# EAGLE design vc_board_v011 (EAGLE 9.6.2)
Wifi2Dmx Bridge WeMos D1 mini MAX485 (SO8) Neutrik NC1FAH1 5050 RGB LED BESTELLT: 30.06.2020
DNAME: Ruemmler, Elias
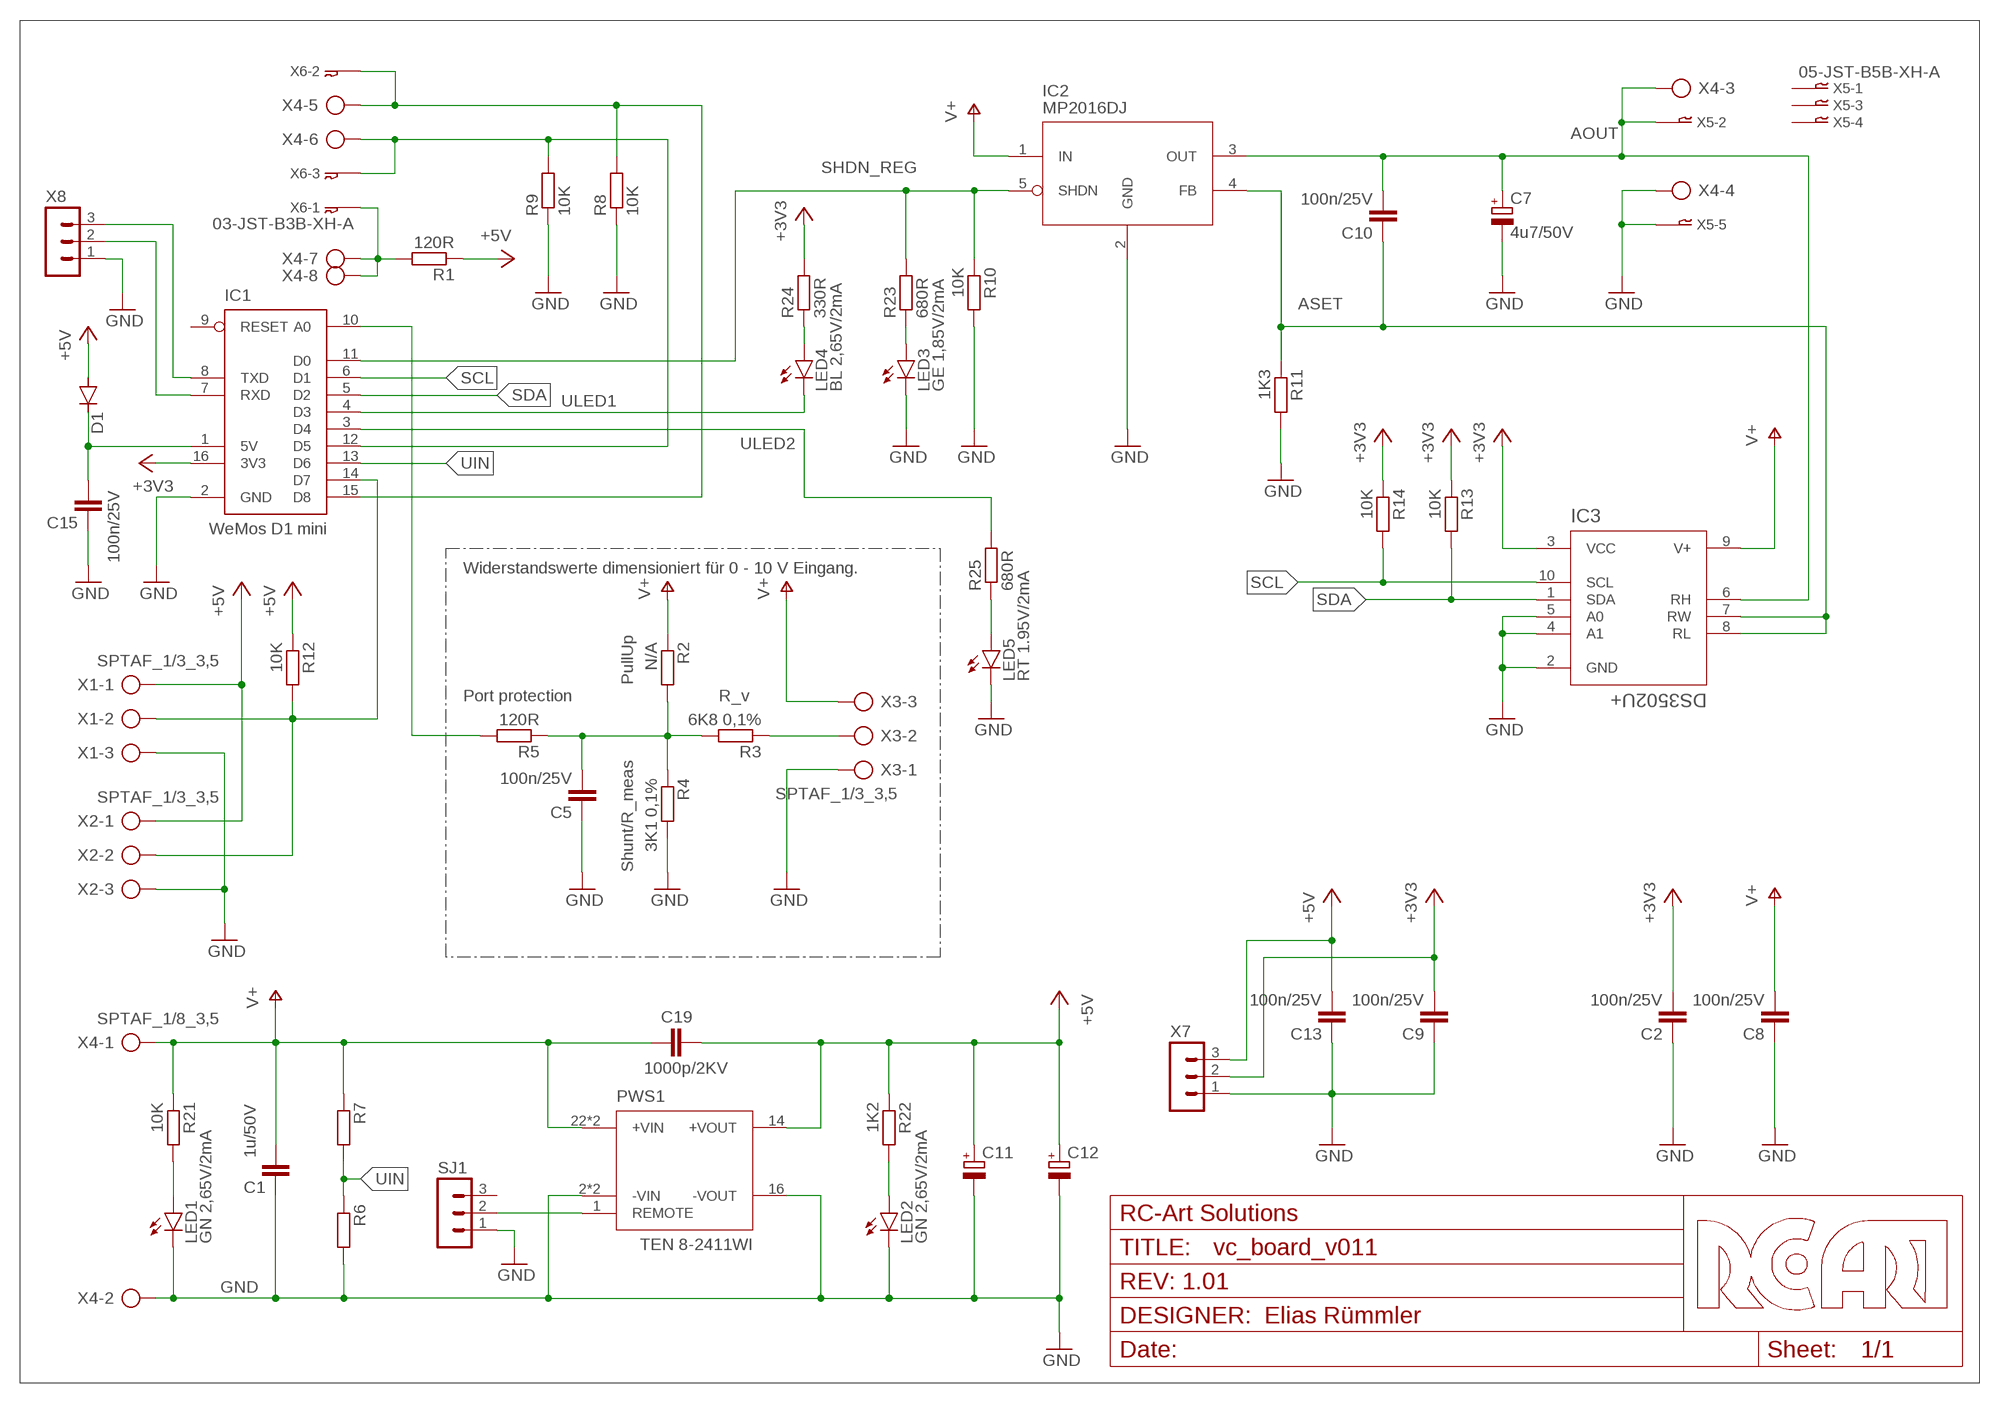
[diagram p0: schematic, sheet 1]

## Parts
C1  1u/50V  C-EUC1210K  [C1210K]
C2  100n/25V  C-EUC0805  [C0805]
C5  100n/25V  C-EUC0805  [C0805]
C7  4u7/50V  CPOL-EUD/7343-31W  [D/7343-31W]
C8  100n/25V  C-EUC0805  [C0805]
C9  100n/25V  C-EUC0805  [C0805]
C10  100n/25V  C-EUC0805  [C0805]
C11  CPOL-EUD/7343-31W  [D/7343-31W]
C12  CPOL-EUD/7343-31W  [D/7343-31W]
C13  100n/25V  C-EUC0805  [C0805]
C15  100n/25V  C-EUC0805  [C0805]
C19  1000p/2KV  C-EUC1206K  [C1206K]
D1  DIODE-SMB  [SMB]
FRAME1  MF_FRAMEDEFAULT  [MF_FRAME_DEFAULT]
IC1  WeMos D1 mini  D1_MINI  [D1_MINI]
IC2  MP2016DJ  MP2016  [TSOT23-5]
IC3  DS3502U+  [21-0061L_MXM]
LED1  GN 2,65V/2mA  LEDCHIPLED_0805  [CHIPLED_0805]
LED2  GN 2,65V/2mA  LEDCHIPLED_0805  [CHIPLED_0805]
LED3  GE 1,85V/2mA  LEDCHIPLED_0805  [CHIPLED_0805]
LED4  BL 2,65V/2mA  LEDCHIPLED_0805  [CHIPLED_0805]
LED5  RT 1.95V/2mA  LEDCHIPLED_0805  [CHIPLED_0805]
PWS1  TEN 8-2411WI  TEN8WI  [TEN8]
R1  120R  R-EU_R0805  [R0805]
R2  N/A  R-EU_R0805  [R0805]
R3  6K8 0,1%  R-EU_R0805  [R0805]
R4  3K1 0,1%  R-EU_R0805  [R0805]
R5  120R  R-EU_R0805  [R0805]
R6  R-EU_R0805  [R0805]
R7  R-EU_R0805  [R0805]
R8  10K  R-EU_R0805  [R0805]
R9  10K  R-EU_R0805  [R0805]
R10  10K  R-EU_R0805  [R0805]
R11  1K3  R-EU_R0805  [R0805]
R12  10K  R-EU_R0805  [R0805]
R13  10K  R-EU_R0805  [R0805]
R14  10K  R-EU_R0805  [R0805]
R21  10K  R-EU_R0805  [R0805]
R22  1K2  R-EU_R0805  [R0805]
R23  680R  R-EU_R0805  [R0805]
R24  330R  R-EU_R0805  [R0805]
R25  680R  R-EU_R0805  [R0805]
SJ1  MA03-1  [MA03-1]
X1  SPTAF_1/3_3,5  [SPTAF_1/3_3,5]
X2  SPTAF_1/3_3,5  [SPTAF_1/3_3,5]
X3  SPTAF_1/3_3,5  [SPTAF_1/3_3,5]
X4  SPTAF_1/8_3,5  [SPTAF_1/8_3,5]
X5  05-JST-B5B-XH-A  [B5B-XH]
X6  03-JST-B3B-XH-A  [B3B-XH]
X7  MA03-1  [MA03-1]
X8  MA03-1  [MA03-1]

## Nets
+3V3: C2.2 C9.2 IC1.16(3V3) IC3.3(VCC) R13.1 R14.1 R24.2 X7.2
+5V: C11.+ C12.+ C13.2 C19.2 D1.A PWS1.14(+VOUT) R1.1 R12.1 R22.1 X1.1 X1.1A X2.1 X2.1A X7.3
AOUT: C7.+ C10.2 IC2.3(OUT) IC3.6(RH) X4.3 X4.3A X5.P$2
ASET: C10.1 IC2.4(FB) IC3.7(RW) IC3.8(RL) R11.1
GND [gnd]: C1.1 C2.1 C5.1 C7.- C8.1 C9.1 C11.- C12.- C13.1 C15.1 IC1.2(GND) IC2.2(GND) IC3.2(GND) IC3.4(A1) IC3.5(A0) LED1.C LED2.C LED3.C LED5.C PWS1.2(-VIN) PWS1.3(-VIN) PWS1.16(-VOUT) R4.2 R6.2 R8.1 R9.1 R10.2 R11.2 SJ1.1 X1.3 X1.3A X2.3 X2.3A X3.1 X3.1A X4.2 X4.2A X4.4 X4.4A X5.P$5 X7.1 X8.1
N$1: C5.2 R2.2 R3.2 R4.1 R5.1
N$2: IC1.12(D5) R9.2 X4.6 X4.6A X6.P$3
N$3: IC1.15(D8) R8.2 X4.5 X4.5A X6.P$2
N$5: R1.2 X4.7 X4.7A X4.8 X4.8A X6.P$1
N$6: R3.1 X3.2 X3.2A
N$7: C15.2 D1.C IC1.1(5V)
N$8: PWS1.1(REMOTE) SJ1.2
N$10: LED3.A R23.1
N$13: LED1.A R21.2
N$14: LED2.A R22.2
N$15: IC1.14(D7) R12.2 X1.2 X1.2A X2.2 X2.2A
N$16: IC1.8(TXD) X8.3
N$17: IC1.7(RXD) X8.2
N$18: LED4.A R24.1
N$19: LED5.A R25.1
N$21: IC1.10(A0) R5.2
SCL: IC1.6(D1) IC3.10(SCL) R14.2
SDA: IC1.5(D2) IC3.1(SDA) R13.2
SHDN_REG: IC1.11(D0) IC2.5(SHDN) R10.1 R23.2
UIN: IC1.13(D6) R6.1 R7.2
ULED1: IC1.4(D3) LED4.C
ULED2: IC1.3(D4) R25.2
V+: C1.2 C8.2 C19.1 IC2.1(IN) IC3.9(V+) PWS1.22(+VIN) PWS1.23(+VIN) R2.1 R7.1 R21.1 X3.3 X3.3A X4.1 X4.1A
Unconnected: IC1.9(RESET) SJ1.3 X5.P$1 X5.P$3 X5.P$4

## Notes on the sheet
- Widerstandswerte dimensioniert für 0 - 10 V Eingang.
- PullUp
- Port protection | R_v
- Shunt/R_meas

## Library data of the parts
C1 C2 C5 C8-C10 C13 C15 C19 = rcl:C-EU: CAPACITOR, European symbol; SPICEPREFIX: C
C7 C11 C12 = rcl:CPOL-EU: POLARIZED CAPACITOR, European symbol; SPICEPREFIX: C
D1 = diode:DIODE-: DIODE
FRAME1 = rca-frames:MF_FRAME: Library: MF_Aesthetics Description: Frame for adding Meta Data to the PCB and Schematic.; DNAME: Elias Rümmler; HOUSEPART: 0; POPULATE: 0; REVNUM: REV: 1.01
IC1 = rca-wemos:D1_MINI
IC2 = mps-regulator:MP2016: MP2016 The MP2016 is a low power linear regulator that supplies power to systems with high voltage batteries. It includes a wide 4V to 42V input range, low dropout voltage and low quiescent supply current.
IC3 = maxim-ds3502:DS3502U+; BUILT_BY: EMA_UL_Team; MANUFACTURER_PART_NUMBER: ds3502u+; REVISION: 2; SOURCELIBRARY: Maxim_2009-12-17_1; VENDOR: Maxim Integrated Products
LED1 LED2 = led:LED: LED OSRAM: - CHIPLED LG R971, LG N971, LY N971, LG Q971, LY Q971, LO R971, LY R971 LH N974, LH R974 LS Q976, LO Q976, LY Q976 LO Q996 - Hyper CHIPLED LW Q18S LB Q993, LB Q99A, LB R99A - SideLED LS A670, LO A670, LY A670, LG A670, LP A670 LB A673, LV A673, LT A673, LW A673 LH A674 LY A675 LS A676, LA A676, LO A676, LY A676, LW A676 LS A679, LY A679, LG A679 - Hyper Micro SIDELED® LS Y876, LA Y876, LO Y876, LY Y876 LT Y87S - SmartLED LW L88C, LW L88S LB L89C, LB L89S, LG L890 LS L89K, LO L89K, LY L89K LS L896, LA L896, LO L896, LY L896 - TOPLED LS T670, LO T670, LY T670, LG T670, LP T670 LSG T670, LSP T670, LSY T670, LOP T670, LYG T670 LG T671, LOG T671, LSG T671 LB T673, LV T673, LT T673, LW T673 LH T674 LS T676, LA T676, LO T676, LY T676, LB T676, LH T676, LSB T676, LW T676 LB T67C, LV T67C, LT T67C, LS T67K, LO T67K, LY T67K, LW E67C LS E67B, LA E67B, LO E67B, LY E67B, LB E67C, LV E67C, LT E67C LW T67C LS T679, LY T679, LG T679 LS T770, LO T770, LY T770, LG T770, LP T770 LB T773, LV T773, LT T773, LW T773 LH T774 LS E675, LA E675, LY E675, LS T675 LS T776, LA T776, LO T776, LY T776, LB T776 LHGB T686 LT T68C, LB T68C - Hyper Mini TOPLED® LB M676 - Mini TOPLED Santana® LG M470 LS M47K, LO M47K, LY M47K Source: http://www.osram.convergy.de LUXEON: - LUMILED® LXK2-PW12-R00, LXK2-PW12-S00, LXK2-PW14-U00, LXK2-PW14-V00 LXK2-PM12-R00, LXK2-PM12-S00, LXK2-PM14-U00 LXK2-PE12-Q00, LXK2-PE12-R00, LXK2-PE12-S00, LXK2-PE14-T00, LXK2-PE14-U00 LXK2-PB12-K00, LXK2-PB12-L00, LXK2-PB12-M00, LXK2-PB14-N00, LXK2-PB14-P00, LXK2-PB14-Q00 LXK2-PR12-L00, LXK2-PR12-M00, LXK2-PR14-Q00, LXK2-PR14-R00 LXK2-PD12-Q00, LXK2-PD12-R00, LXK2-PD12-S00 LXK2-PH12-R00, LXK2-PH12-S00 LXK2-PL12-P00, LXK2-PL12-Q00, LXK2-PL12-R00 Source: www.luxeon.com KINGBRIGHT: KA-3528ASYC Source: www.kingbright.com; FARNELL_SKU: 2846598
LED3 = led:LED: LED OSRAM: - CHIPLED LG R971, LG N971, LY N971, LG Q971, LY Q971, LO R971, LY R971 LH N974, LH R974 LS Q976, LO Q976, LY Q976 LO Q996 - Hyper CHIPLED LW Q18S LB Q993, LB Q99A, LB R99A - SideLED LS A670, LO A670, LY A670, LG A670, LP A670 LB A673, LV A673, LT A673, LW A673 LH A674 LY A675 LS A676, LA A676, LO A676, LY A676, LW A676 LS A679, LY A679, LG A679 - Hyper Micro SIDELED® LS Y876, LA Y876, LO Y876, LY Y876 LT Y87S - SmartLED LW L88C, LW L88S LB L89C, LB L89S, LG L890 LS L89K, LO L89K, LY L89K LS L896, LA L896, LO L896, LY L896 - TOPLED LS T670, LO T670, LY T670, LG T670, LP T670 LSG T670, LSP T670, LSY T670, LOP T670, LYG T670 LG T671, LOG T671, LSG T671 LB T673, LV T673, LT T673, LW T673 LH T674 LS T676, LA T676, LO T676, LY T676, LB T676, LH T676, LSB T676, LW T676 LB T67C, LV T67C, LT T67C, LS T67K, LO T67K, LY T67K, LW E67C LS E67B, LA E67B, LO E67B, LY E67B, LB E67C, LV E67C, LT E67C LW T67C LS T679, LY T679, LG T679 LS T770, LO T770, LY T770, LG T770, LP T770 LB T773, LV T773, LT T773, LW T773 LH T774 LS E675, LA E675, LY E675, LS T675 LS T776, LA T776, LO T776, LY T776, LB T776 LHGB T686 LT T68C, LB T68C - Hyper Mini TOPLED® LB M676 - Mini TOPLED Santana® LG M470 LS M47K, LO M47K, LY M47K Source: http://www.osram.convergy.de LUXEON: - LUMILED® LXK2-PW12-R00, LXK2-PW12-S00, LXK2-PW14-U00, LXK2-PW14-V00 LXK2-PM12-R00, LXK2-PM12-S00, LXK2-PM14-U00 LXK2-PE12-Q00, LXK2-PE12-R00, LXK2-PE12-S00, LXK2-PE14-T00, LXK2-PE14-U00 LXK2-PB12-K00, LXK2-PB12-L00, LXK2-PB12-M00, LXK2-PB14-N00, LXK2-PB14-P00, LXK2-PB14-Q00 LXK2-PR12-L00, LXK2-PR12-M00, LXK2-PR14-Q00, LXK2-PR14-R00 LXK2-PD12-Q00, LXK2-PD12-R00, LXK2-PD12-S00 LXK2-PH12-R00, LXK2-PH12-S00 LXK2-PL12-P00, LXK2-PL12-Q00, LXK2-PL12-R00 Source: www.luxeon.com KINGBRIGHT: KA-3528ASYC Source: www.kingbright.com; FARNELL_SKU: 2846596
LED4 = led:LED: LED OSRAM: - CHIPLED LG R971, LG N971, LY N971, LG Q971, LY Q971, LO R971, LY R971 LH N974, LH R974 LS Q976, LO Q976, LY Q976 LO Q996 - Hyper CHIPLED LW Q18S LB Q993, LB Q99A, LB R99A - SideLED LS A670, LO A670, LY A670, LG A670, LP A670 LB A673, LV A673, LT A673, LW A673 LH A674 LY A675 LS A676, LA A676, LO A676, LY A676, LW A676 LS A679, LY A679, LG A679 - Hyper Micro SIDELED® LS Y876, LA Y876, LO Y876, LY Y876 LT Y87S - SmartLED LW L88C, LW L88S LB L89C, LB L89S, LG L890 LS L89K, LO L89K, LY L89K LS L896, LA L896, LO L896, LY L896 - TOPLED LS T670, LO T670, LY T670, LG T670, LP T670 LSG T670, LSP T670, LSY T670, LOP T670, LYG T670 LG T671, LOG T671, LSG T671 LB T673, LV T673, LT T673, LW T673 LH T674 LS T676, LA T676, LO T676, LY T676, LB T676, LH T676, LSB T676, LW T676 LB T67C, LV T67C, LT T67C, LS T67K, LO T67K, LY T67K, LW E67C LS E67B, LA E67B, LO E67B, LY E67B, LB E67C, LV E67C, LT E67C LW T67C LS T679, LY T679, LG T679 LS T770, LO T770, LY T770, LG T770, LP T770 LB T773, LV T773, LT T773, LW T773 LH T774 LS E675, LA E675, LY E675, LS T675 LS T776, LA T776, LO T776, LY T776, LB T776 LHGB T686 LT T68C, LB T68C - Hyper Mini TOPLED® LB M676 - Mini TOPLED Santana® LG M470 LS M47K, LO M47K, LY M47K Source: http://www.osram.convergy.de LUXEON: - LUMILED® LXK2-PW12-R00, LXK2-PW12-S00, LXK2-PW14-U00, LXK2-PW14-V00 LXK2-PM12-R00, LXK2-PM12-S00, LXK2-PM14-U00 LXK2-PE12-Q00, LXK2-PE12-R00, LXK2-PE12-S00, LXK2-PE14-T00, LXK2-PE14-U00 LXK2-PB12-K00, LXK2-PB12-L00, LXK2-PB12-M00, LXK2-PB14-N00, LXK2-PB14-P00, LXK2-PB14-Q00 LXK2-PR12-L00, LXK2-PR12-M00, LXK2-PR14-Q00, LXK2-PR14-R00 LXK2-PD12-Q00, LXK2-PD12-R00, LXK2-PD12-S00 LXK2-PH12-R00, LXK2-PH12-S00 LXK2-PL12-P00, LXK2-PL12-Q00, LXK2-PL12-R00 Source: www.luxeon.com KINGBRIGHT: KA-3528ASYC Source: www.kingbright.com; FARNELL_SKU: 2846594
LED5 = led:LED: LED OSRAM: - CHIPLED LG R971, LG N971, LY N971, LG Q971, LY Q971, LO R971, LY R971 LH N974, LH R974 LS Q976, LO Q976, LY Q976 LO Q996 - Hyper CHIPLED LW Q18S LB Q993, LB Q99A, LB R99A - SideLED LS A670, LO A670, LY A670, LG A670, LP A670 LB A673, LV A673, LT A673, LW A673 LH A674 LY A675 LS A676, LA A676, LO A676, LY A676, LW A676 LS A679, LY A679, LG A679 - Hyper Micro SIDELED® LS Y876, LA Y876, LO Y876, LY Y876 LT Y87S - SmartLED LW L88C, LW L88S LB L89C, LB L89S, LG L890 LS L89K, LO L89K, LY L89K LS L896, LA L896, LO L896, LY L896 - TOPLED LS T670, LO T670, LY T670, LG T670, LP T670 LSG T670, LSP T670, LSY T670, LOP T670, LYG T670 LG T671, LOG T671, LSG T671 LB T673, LV T673, LT T673, LW T673 LH T674 LS T676, LA T676, LO T676, LY T676, LB T676, LH T676, LSB T676, LW T676 LB T67C, LV T67C, LT T67C, LS T67K, LO T67K, LY T67K, LW E67C LS E67B, LA E67B, LO E67B, LY E67B, LB E67C, LV E67C, LT E67C LW T67C LS T679, LY T679, LG T679 LS T770, LO T770, LY T770, LG T770, LP T770 LB T773, LV T773, LT T773, LW T773 LH T774 LS E675, LA E675, LY E675, LS T675 LS T776, LA T776, LO T776, LY T776, LB T776 LHGB T686 LT T68C, LB T68C - Hyper Mini TOPLED® LB M676 - Mini TOPLED Santana® LG M470 LS M47K, LO M47K, LY M47K Source: http://www.osram.convergy.de LUXEON: - LUMILED® LXK2-PW12-R00, LXK2-PW12-S00, LXK2-PW14-U00, LXK2-PW14-V00 LXK2-PM12-R00, LXK2-PM12-S00, LXK2-PM14-U00 LXK2-PE12-Q00, LXK2-PE12-R00, LXK2-PE12-S00, LXK2-PE14-T00, LXK2-PE14-U00 LXK2-PB12-K00, LXK2-PB12-L00, LXK2-PB12-M00, LXK2-PB14-N00, LXK2-PB14-P00, LXK2-PB14-Q00 LXK2-PR12-L00, LXK2-PR12-M00, LXK2-PR14-Q00, LXK2-PR14-R00 LXK2-PD12-Q00, LXK2-PD12-R00, LXK2-PD12-S00 LXK2-PH12-R00, LXK2-PH12-S00 LXK2-PL12-P00, LXK2-PL12-Q00, LXK2-PL12-R00 Source: www.luxeon.com KINGBRIGHT: KA-3528ASYC Source: www.kingbright.com; FARNELL_SKU: 2099241
PWS1 = dc-dc-traco:TEN8WI
R1-R14 R21-R25 = rcl:R-EU_: RESISTOR, European symbol; SPICEPREFIX: R
SJ1 X7 X8 = con-lstb:MA03-1: PIN HEADER; OC_FARNELL: unknown; OC_NEWARK: unknown
X1-X3 = con-phoenix-sptaf:SPTAF_1/3_3,5: Leiterplattenklemme - SPTAF 1/ 3-3,5-IL Leiterplattenklemme, Nennstrom: 16 A, Bemessungsspannung (III/2): 160 V, Nennquerschnitt: 1,5 mm², Anzahl der Potenziale: 3, Anzahl der Reihen: 1, Polzahl pro Reihe: 8, Artikelfamilie: SPTAF 1/..-IL, Rastermaß: 3,5 mm, Anschlussart: Push-in-Federanschluss, Montage: Wellenlöten, Anschlussrichtung Leiter/Platine: 45 °, Farbe: grün, Pin-Layout: Lineares Doppel-Pinning, Pinlänge [P]: 2,6 mm, Verpackungsart: verpackt im Karton
X4 = con-phoenix-sptaf:SPTAF_1/8_3,5: Leiterplattenklemme - SPTAF 1/ 8-3,5-IL - 1861991 Leiterplattenklemme, Nennstrom: 16 A, Bemessungsspannung (III/2): 160 V, Nennquerschnitt: 1,5 mm², Anzahl der Potenziale: 8, Anzahl der Reihen: 1, Polzahl pro Reihe: 8, Artikelfamilie: SPTAF 1/..-IL, Rastermaß: 3,5 mm, Anschlussart: Push-in-Federanschluss, Montage: Wellenlöten, Anschlussrichtung Leiter/Platine: 45 °, Farbe: grün, Pin-Layout: Lineares Doppel-Pinning, Pinlänge [P]: 2,6 mm, Verpackungsart: verpackt im Karton; MF: FARNELL; MPN: 1861991; OC_FARNELL: 2580663; OC_NEWARK: 71C4133
X5 = con-jst-xh:05-JST: JST CONNECTOR
X6 = con-jst-xh:03-JST: JST CONNECTOR

## Net classes
0 default: clearance 0.15 mm
1 gnd: clearance 0.3 mm to class 0, clearance 0.3 mm

## Board
Wifi2Dmx Bridge WeMos D1 mini MAX485 (SO8) Neutrik NC1FAH1 5050 RGB LED BESTELLT: 30.06.2020
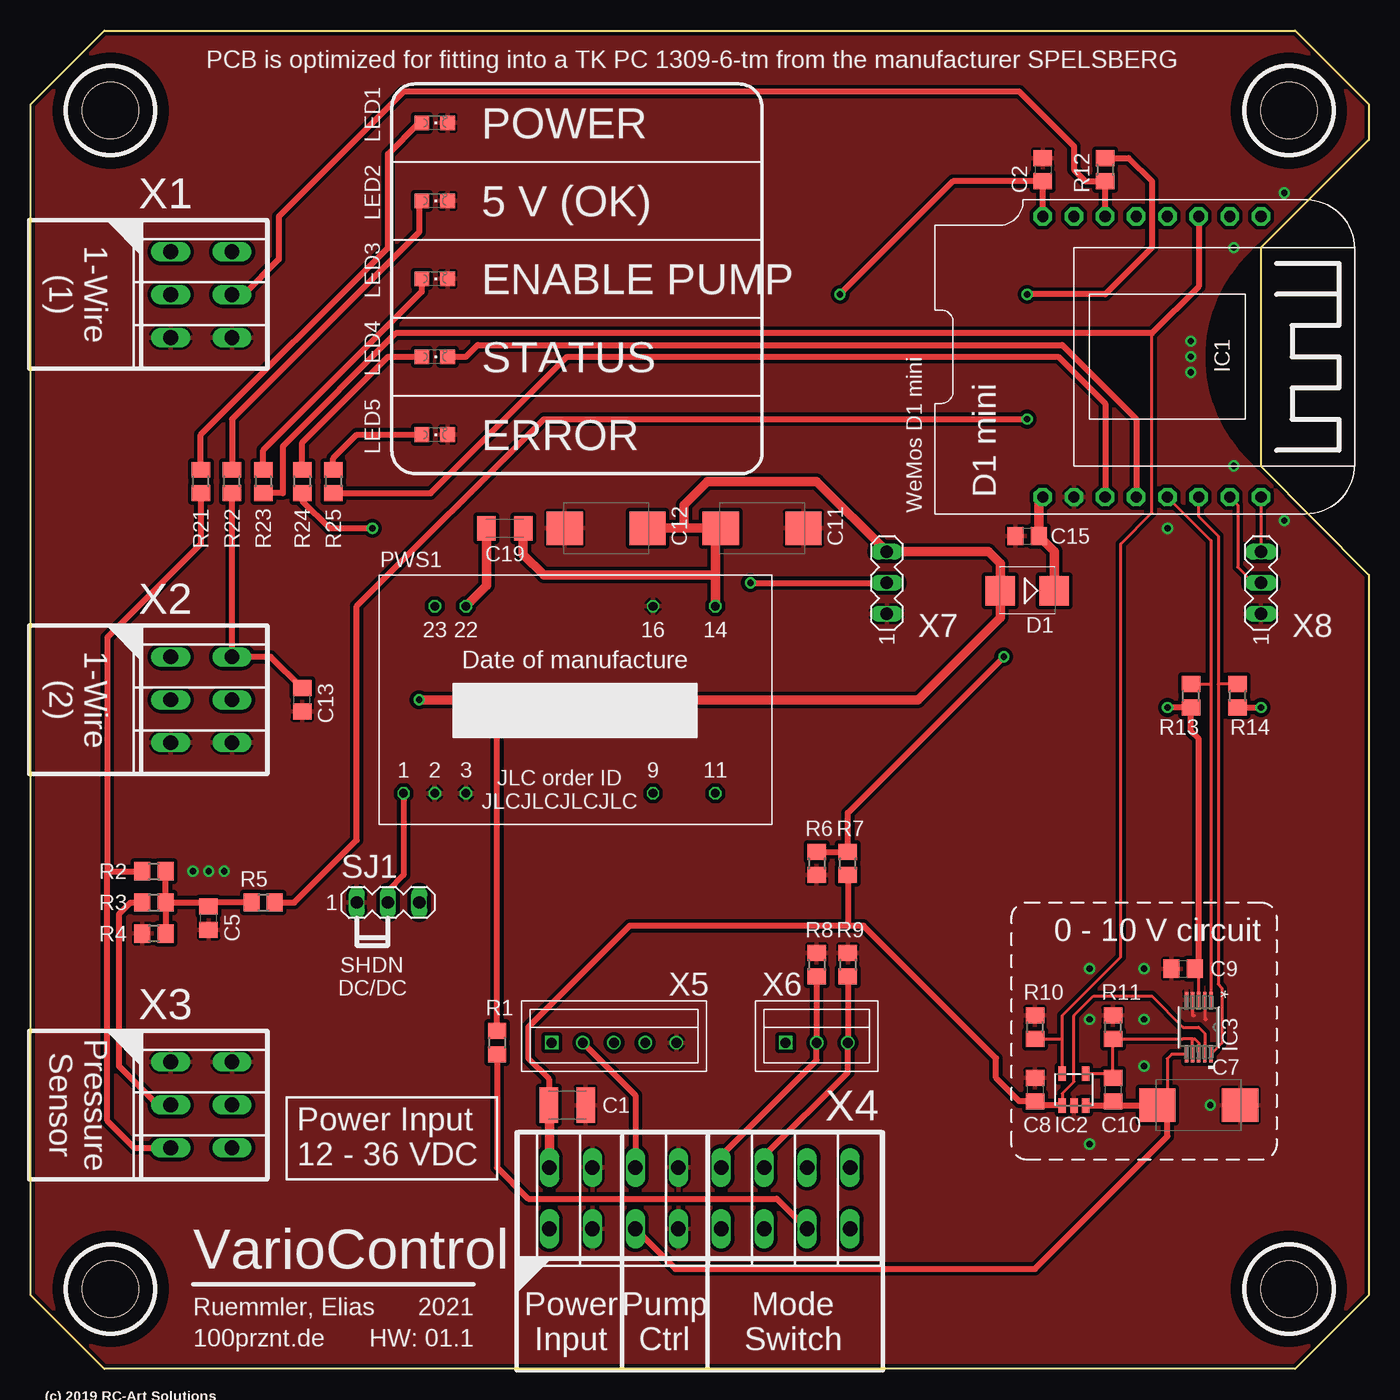
[diagram p1: board, top side]
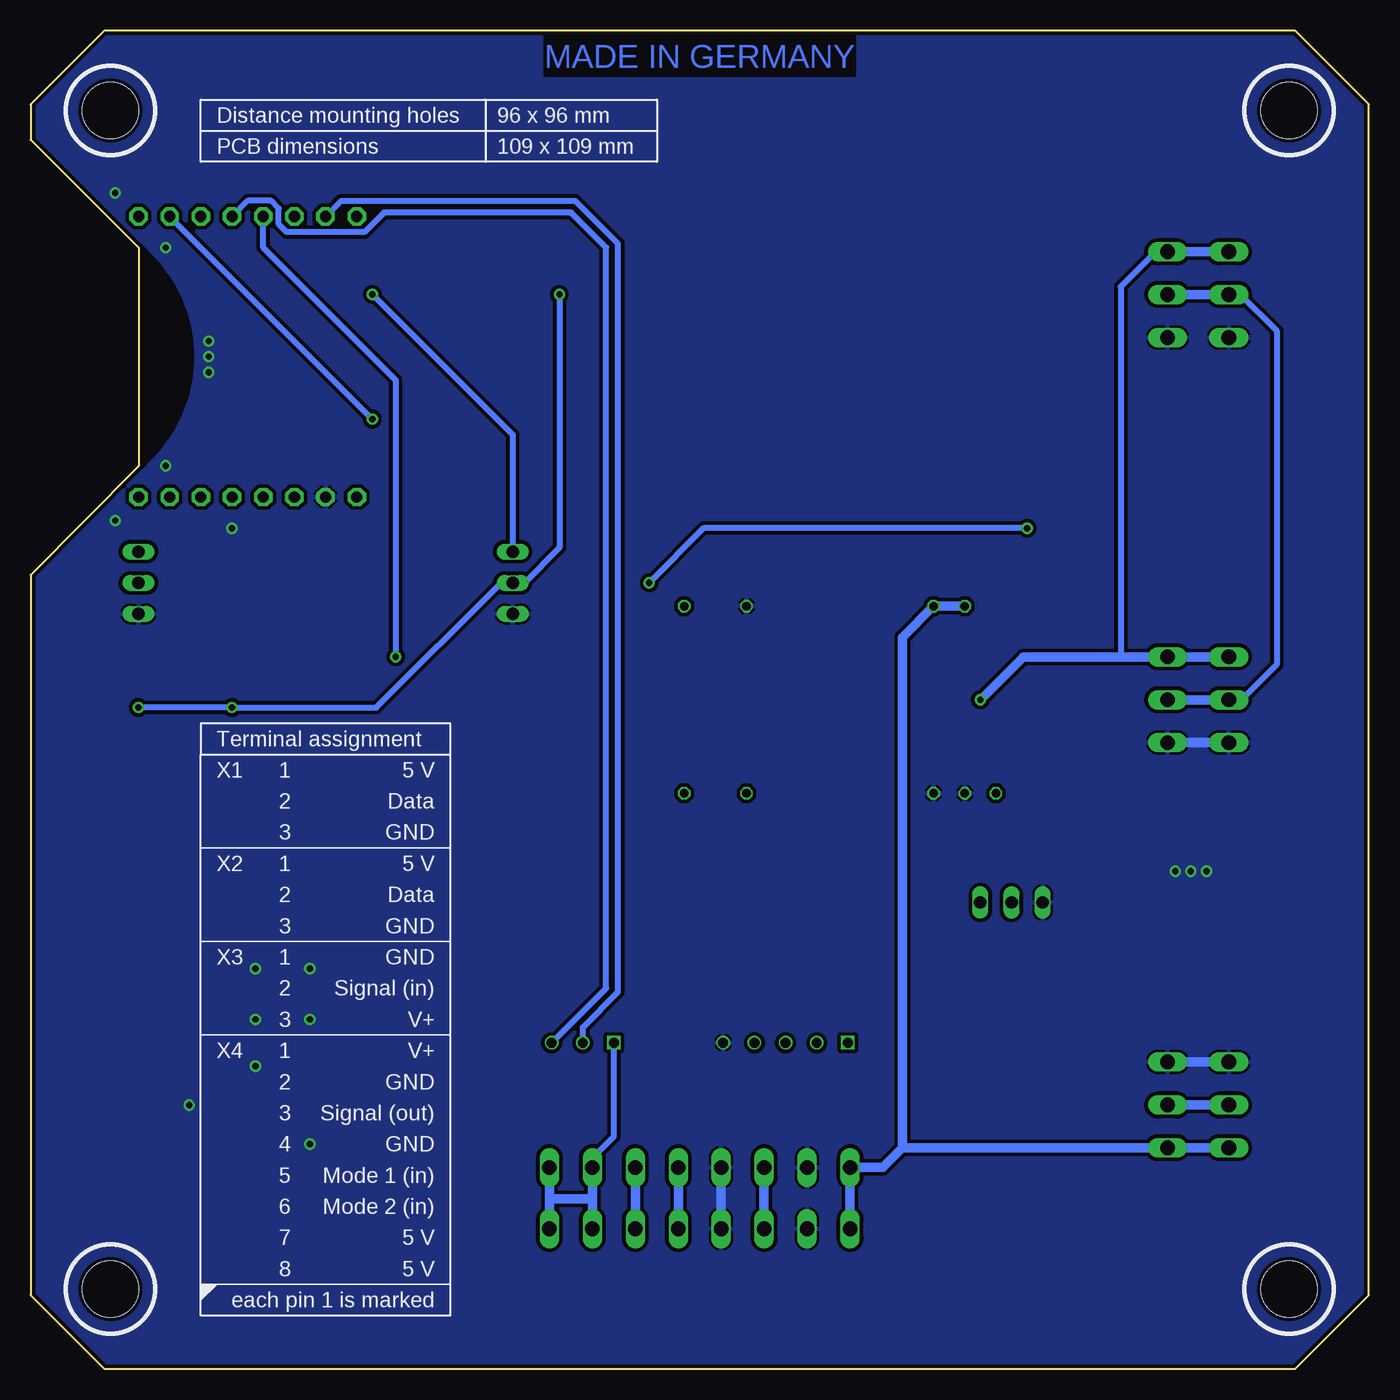
[diagram p2: board, bottom side, seen from below]

Size 109 x 109 mm. Coordinates in mm from the lower left corner, seen from the top.
Outline: 103,0 6,0 0,6 0,103 6,109 103,109 109,103 109,100.11 100.22,91.33 100.22,73.55 109,64.66 109,6 103,0
Copper layers (1*16): Top 0.035mm / dielectric 1.6mm / Bottom 0.035mm
Design rules "JLCPCB_doublelayer": minimum track width 5mil, minimum drill 0.3mm, track to track 5mil, track to pad 5mil, pad to pad 5mil, via to via 5mil, smd to smd 5mil, copper to edge 0.3mm, drill to drill 0.2mm, minimum pad ring 0.15mm, minimum via ring 0.15mm, stop-mask expansion 0.075mm, vias tented up to drill 0mil, thermal gap 0.2mm
Holes 4.6 mm at 6.5,102.5 6.5,6.5 102.5,102.5 102.5,6.5
tRestrict: area 2,98 to 11,107; area 98,98 to 107,107; area 98,2 to 107,11; area 2,2 to 11,11; area 96.1,73.5 to 100.2,91.3
bRestrict: area 41.8,105.3 to 67.2,109.1; area 96.1,73.5 to 100.2,91.3

### Footprints (pad centres in the part's own frame; a part is rotated, then mirrored left to right if it is on the bottom)
C1210K = smd 1.5 x 2.9: 1 -1.5,0; 2 1.5,0
C0805 = smd 1.3 x 1.5: 1 -0.95,0; 2 0.95,0
D/7343-31W = smd 2.95 x 2.7: + 3.375,0; - -3.375,0
C1206K = smd 1.5 x 2: 1 -1.5,0; 2 1.5,0
SMB = smd 2.4 x 2.4: A 2.2,0; C -2.2,0
D1_MINI = drill 0.9 pad 1.5 octagon: 1 11.43,0; 2 11.43,2.54; 3 11.43,5.08; 4 11.43,7.62; 5 11.43,10.16; 6 11.43,12.7; 7 11.43,15.24; 8 11.43,17.78; 9 -11.43,17.78; 10 -11.43,15.24; 11 -11.43,12.7; 12 -11.43,10.16; 13 -11.43,7.62; 14 -11.43,5.08; 15 -11.43,2.54; 16 -11.43,0
TSOT23-5 = smd 0.6 x 1.2: 1 -0.95,-1.3; 2 0,-1.3; 3 0.95,-1.3; 4 0.95,1.3; 5 -0.95,1.3
21-0061L_MXM = smd 1.359 x 0.279: 1 -2.203,1; 2 -2.203,0.5; 3 -2.203,0; 4 -2.203,-0.5; 5 -2.203,-1; 6 2.203,-1; 7 2.203,-0.5; 8 2.203,0; 9 2.203,0.5; 10 2.203,1
CHIPLED_0805 = smd 1.2 x 1.2: A 0,-1.05; C 0,1.05
TEN8 = drill 0.7 octagon: 1 -13.97,-7.62; 2 -11.43,-7.62; 3 -8.89,-7.62; 9 6.35,-7.62; 11 11.43,-7.62; 14 11.43,7.62; 16 6.35,7.62; 22 -8.89,7.62; 23 -11.43,7.62
R0805 = smd 1.3 x 1.5: 1 -0.95,0; 2 0.95,0
MA03-1 = drill 1.016 long: 1 -2.54,0; 2 0,0; 3 2.54,0
SPTAF_1/3_3,5 = drill 1.2 pad 1.6 long: 1 0,0; 1A 0,-5; 2 3.5,0; 2A 3.5,-5; 3 7,0; 3A 7,-5
SPTAF_1/8_3,5 = drill 1.2 pad 1.6 long: 1 0,0; 1A 0,-5; 2 3.5,0; 2A 3.5,-5; 3 7,0; 3A 7,-5; 4 10.5,0; 4A 10.5,-5; 5 14,0; 5A 14,-5; 6 17.5,0; 6A 17.5,-5; 7 21,0; 7A 21,-5; 8 24.5,0; 8A 24.5,-5
B5B-XH = drill 0.8 square: P$1 -5.08,0 | drill 0.8: P$2 -2.54,0; P$3 0,0; P$4 2.54,0; P$5 5.08,0
B3B-XH = drill 0.8 square: P$1 -2.54,0 | drill 0.8: P$2 0,0; P$3 2.54,0

### Placement (x,y rotation side)
C1  43.7,21.48 180 top
C2  82.44,97.68 270 top
C5  14.49,36.72 90 top
C7  95.14,21.48 180 top
C8  81.81,22.75 270 top
C9  93.87,32.59 0 top
C10  88.16,22.75 270 top
C11  59.58,68.47 180 top
C12  46.88,68.47 0 top
C13  22.12,54.5 90 top
C15  81.17,67.84 0 top
C19  38.62,68.47 0 top
D1  81.17,63.39 180 top
FRAME1  1.16,-1.38 0 top
IC1  82.44,82.44 270 top
IC2  84.98,22.75 0 top
IC3  95.14,27.83 270 top
LED1  32.91,101.49 270 top
LED2  32.91,95.14 270 top
LED3  32.91,88.79 270 top
LED4  32.91,82.44 270 top
LED5  32.91,76.09 270 top
PWS1  44.34,54.5 0 top
R1  37.99,26.56 270 top
R2  10.05,40.53 0 top
R3  10.05,37.99 0 top
R4  10.05,35.45 180 top
R5  18.94,37.99 0 top
R6  64.03,41.16 270 top
R7  66.56,41.16 90 top
R8  64.03,32.91 270 top
R9  66.56,32.91 270 top
R10  81.81,27.83 90 top
R11  88.16,27.83 90 top
R12  87.52,97.68 270 top
R13  94.5,54.82 90 top
R14  98.31,54.82 90 top
R21  13.86,72.28 90 top
R22  16.4,72.28 90 top
R23  18.94,72.28 270 top
R24  22.12,72.28 270 top
R25  24.66,72.28 270 top
SJ1  29.1,37.99 0 top
X1  16.4,91 270 top
X2  16.4,58 270 top
X3  16.4,25 270 top
X4  42.25,16.4 0 top
X5  47.52,26.56 0 top
X6  64.03,26.56 0 top
X7  69.74,64.03 90 top
X8  100.22,64.03 90 top

### Tracks (layer width: path | path; a pad name or v marks a point on that pad's centre or on a via)
+3V3  (via drill 0.51)
  Top 0.254: IC3.3 95.14,32.59 C9.2
  Top 0.508: v65.93,87.52 75.14,96.73 C2.2 IC1.16 | C9.2 95.14,32.91 95.14,51.33 94.5,51.96 R13.1 v92.6,53.87 | R14.1 v100.22,53.87 | R24.2 22.12,70.69 24.34,68.47 v27.83,68.47 | v58.63,64.03 X7.2
  Bottom 0.508: v100.22,53.87 v92.6,53.87 80.85,53.87 70.69,64.03 X7.2 68.79,64.03 65.93,66.88 v65.93,87.52 | v27.83,68.47 54.18,68.47 v58.63,64.03
+5V  (via drill 0.51)
  Top 0.508: v81.17,87.52 87.52,87.52 91.33,91.33 91.33,96.72 89.42,98.63 R12.1 | C13.2 19.56,58 X2.1 R22.1 | R1.1 37.99,54.5 40.53,54.5
  Top 0.762: v31.64,54.5 40.53,54.5 72.28,54.5 78.97,61.19 D1.A 78.97,65.59 78,66.56 X7.3 64.03,72.28 55.13,72.28 53.23,70.38 53.23,68.47 | PWS1.14 55.77,64.66 | 55.77,64.66 55.77,68.03 C11.+ 53.23,68.47 | C19.2 40.12,66.34 41.8,64.66 55.77,64.66 | 53.23,68.47 C12.+
  Bottom 0.508: X1.1 17.35,91 20.21,88.14 20.21,58 | v81.17,87.52 69.74,76.09 X7.3
  Bottom 0.762: X2.1A X2.1 20.21,58 28.14,58 v31.64,54.5 | X1.1A X1.1
AOUT
  Top 0.254: 92.6,21.48 C7.+ | IC3.6 92.94,25.63 92.57,25.26 92.57,21.45
  Top 0.508: C10.2 87.81,21.45 IC2.3 92.57,21.45 | 92.57,21.45 92.6,21.48 | X4.3A 52.51,8.15 81.81,8.15 92.6,18.94 92.6,21.42 92.57,21.45 | X5.P$2 49.25,22.28 X4.3
  Bottom 0.762: X4.3A X4.3
ASET
  Top 0.254: IC2.4 88.16,24.05 C10.1 R11.1 93.87,26.88 94.64,26.88 | 94.64,26.88 94.82,26.88 95.14,26.56 IC3.8 | IC3.7 94.64,26.88
GND  (via drill 0.51)
  Top 0.254: IC3.2 95.64,28.46 95.78,28.46 | IC3.4 94.64,28.78 94.82,28.78
  Bottom 0.762: X4.4A X4.4 | X3.1 X3.1A | X2.3A X2.3
  other vias: 90.69,28.46 86.25,18.3 96.09,21.48 90.69,32.59 92.6,68.47 14.49,40.53 13.23,40.53 90.69,24.66 102.12,69.11 98,73.55 98,91.33 102.12,95.78 86.25,32.59 86.25,28.46 15.77,40.53 94.5,82.44 94.5,81.17 94.5,83.71
  pour Bottom: -0.11,-0.11 -0.11,109.11 109.11,109.11 109.11,-0.11
  pour Top: -0.11,109.11 -0.11,-0.11 109.11,-0.11 109.11,109.11
N$1
  Top 0.508: R3.2 R4.1 | R3.2 R2.2 | R3.2 14.17,37.99 | 14.17,37.99 C5.2 | R5.1 14.17,37.99
N$2
  Top 0.508: X4.6 59.75,17.35 66.56,24.17 X6.P$3 R9.2
  Bottom 0.508: X6.P$3 62.12,31 62.12,91.33 64.98,94.19 80.22,94.19 81.81,92.6 88.16,92.6 88.79,93.23 88.79,94.5 89.42,95.14 91.33,95.14 IC1.12
  Bottom 0.762: X4.6A X4.6
N$3
  Top 0.508: X4.5 56.25,17.35 64.03,25.13 X6.P$2 R8.2
  Bottom 0.508: X6.P$2 64.03,27.83 61.17,30.69 61.17,91.65 64.66,95.14 83.71,95.14 IC1.15
  Bottom 0.762: X4.5A X4.5
N$5
  Top 0.508: X4.7A 60.79,13.86 40.53,13.86 37.99,16.4 R1.2
  Bottom 0.508: X4.7 63.25,17.17 61.48,18.94 X6.P$1
  Bottom 0.762: X4.7A 63.25,13.86 | 63.25,13.86 X4.7 | X4.8A 66.75,13.86 | 66.75,13.86 X4.8 | 63.25,13.86 66.75,13.86
N$6
  Top 0.508: X3.2A 10.35,21.5 7.19,24.66 7.19,37.04 8.15,37.99 R3.1
  Bottom 0.762: X3.2A X3.2
N$7
  Top 0.762: D1.C 83.37,66.59 C15.2 82.12,70.69 IC1.1
N$8
  Top 0.508: PWS1.1 30.37,40.21 29.1,38.94 SJ1.2
N$10
  Top 0.508: R23.1 18.94,74.82 31.86,87.74 LED3.A
N$13
  Top 0.508: R21.2 13.86,76.09 29.1,91.33 29.1,98.95 31.64,101.49 LED1.A
N$14
  Top 0.508: LED2.A 31.64,94.92 31.64,92.6 16.4,77.36 R22.2
N$15
  Top 0.508: IC1.14 R12.2 85.93,96.73 84.98,97.68 84.98,99.59 80.53,104.03 30.37,104.03 20.21,93.87 20.21,90.38 17.33,87.5 X1.2
  Bottom 0.508: X1.2A 10.45,87.5 7.51,84.56 7.51,57.36 10.37,54.5 11.32,54.5 X2.2A
  Bottom 0.762: X1.2 X1.2A | X2.2 11.32,54.5
N$16
  Top 0.254: IC1.8 X8.3
N$17
  Top 0.254: IC1.7 98.31,70.38 98.31,65.3 99.59,64.03 X8.2
N$18
  Top 0.508: R24.1 22.12,75.45 29.1,82.44 LED4.A
N$19
  Top 0.508: R25.1 24.66,74.19 26.56,76.09 LED5.A
N$21  (via drill 0.51)
  Top 0.508: R5.2 21.48,37.99 26.56,43.07 26.56,62.12 41.8,77.36 v81.17,77.36
  Bottom 0.508: v81.17,77.36 IC1.10
SCL
  Top 0.254: IC1.6 95.14,69.42 96.73,67.84 96.73,55.77 | 96.73,55.77 96.73,31.32 97.05,31 97.05,26.53 IC3.10 | R14.2 96.73,55.77
SDA
  Top 0.254: IC1.5 96.14,67.47 96.14,55.77 | 96.14,55.77 IC3.1 | R13.2 96.14,55.77
SHDN_REG
  Top 0.254: IC2.5 84.03,26.88 | 84.03,26.88 84.03,28.79 88.79,33.55 88.79,67.2 91.33,69.74 91.33,84.34 | R10.1 84.03,26.88
  Top 0.508: IC1.11 95.14,88.16 91.33,84.34 29.73,84.34 20.53,75.14 20.53,71.33 R23.2
UIN  (via drill 0.51)
  Top 0.508: v79.27,57.99 66.56,45.29 R7.2 R6.1
  Bottom 0.508: IC1.13 90.06,91.33 79.27,80.53 v79.27,57.99
ULED1
  Top 0.508: IC1.4 90.06,77.36 84.03,83.39 36.4,83.39 35.45,82.44 LED4.C
ULED2
  Top 0.508: IC1.3 87.52,78.63 83.71,82.44 43.7,82.44 32.59,71.33 R25.2
V+
  Top 0.254: IC2.1 84.03,22.44 84.98,23.39 84.98,28.78 86.57,30.37 91.33,30.37 93.87,27.83 95.14,27.83 95.64,27.33 IC3.9
  Top 0.508: 66.56,36.09 48.78,36.09 40.53,27.83 40.53,25.29 42.2,23.61 C1.2 | X3.3A 8.45,18 6.24,20.21 6.24,40.53 | 6.24,40.53 R2.1 | IC2.1 82.09,21.45 C8.2 80.53,21.8 78.63,23.7 78.63,25.29 67.84,36.09 66.56,36.09 | R7.1 66.56,36.09 | R21.1 13.86,67.2 6.24,59.58 6.24,40.53
  Top 0.762: X4.1 42.25,21.44 C1.2 | PWS1.22 37.12,63.8 C19.1
  Bottom 0.762: X4.1A X4.1 39.59,16.4 37.99,18 | X3.3A X3.3 37.99,18 | PWS1.23 PWS1.22 37.99,59.58 37.99,18

### Text on the board
Bottom: MADE IN GERMANY
tPlace: PCB is optimized for fitting into a TK PC 1309-6-tm from the manufacturer SPELSBERG | POWER | 5 V (OK) | 1-Wire / (1) | ENABLE PUMP | STATUS | ERROR | Date of manufacture | 1-Wire / (2) | JLC order ID | JLCJLCJLCJLC | 0 - 10 V circuit | SHDN / DC/DC | Pressure / Sensor | Power Input / 12 - 36 VDC | VarioControl | Power / Input | Pump / Ctrl | Mode / Switch | Ruemmler, Elias | 2021 | 100prznt.de | HW: 01.1
bPlace: 96 x 96 mm / 109 x 109 mm | Distance mounting holes / PCB dimensions | Terminal assignment | 5 V / Data / GND / 5 V / Data / GND / GND / Signal (in) / V+ / V+ / GND / Signal (out) / GND / Mode 1 (in) / Mode 2 (in) / 5 V / 5 V / each pin 1 is marked | 1 / 2 / 3 / 1 / 2 / 3 / 1 / 2 / 3 / 1 / 2 / 3 / 4 / 5 / 6 / 7 / 8 | X1 / / / X2 / / / X3 / / / X4
tStop: #OpenPoolControl | #100prznt